# Altium schematic sheet Ring 3.SchDoc
size A; SheetNumber: 13; SheetTotal: 30
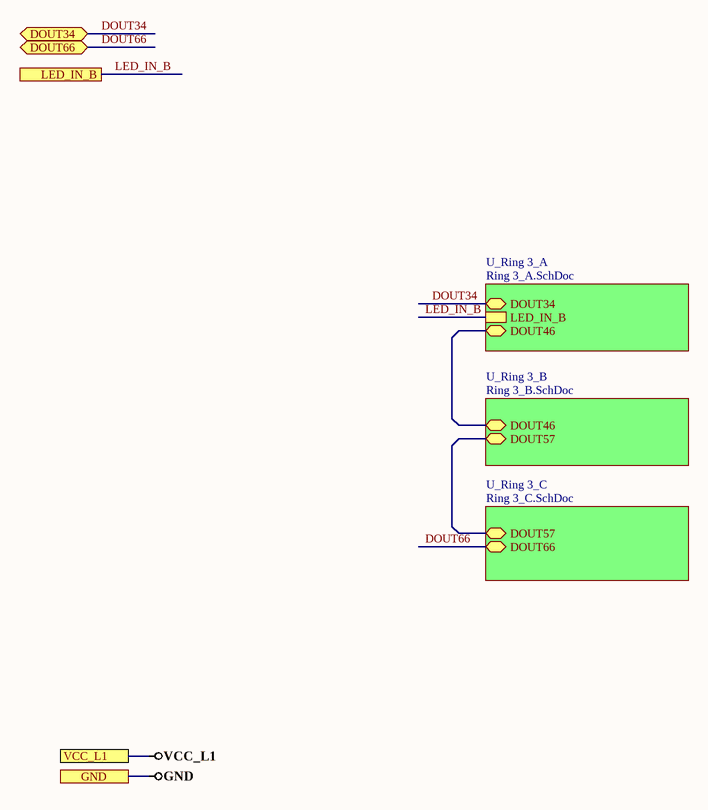
[diagram p0: Ring 3.SchDoc]

## Sub-sheets
U_Ring 3_A = Ring 3_A.SchDoc: DOUT34 (bidir), DOUT46 (bidir), LED_IN_B
U_Ring 3_B = Ring 3_B.SchDoc: DOUT57 (bidir), DOUT46 (bidir)
U_Ring 3_C = Ring 3_C.SchDoc: DOUT66 (bidir), DOUT57 (bidir)

## Ports
DOUT34 (bidir), DOUT66 (bidir), GND, LED_IN_B, VCC_L1

## Nets
GND: port GND
VCC_L1: port VCC_L1
DOUT34: port DOUT34, sheet U_Ring 3_A/DOUT34
DOUT66: port DOUT66, sheet U_Ring 3_C/DOUT66
LED_IN_B: port LED_IN_B, sheet U_Ring 3_A/LED_IN_B
(unnamed): sheet U_Ring 3_B/DOUT57, sheet U_Ring 3_C/DOUT57
(unnamed): sheet U_Ring 3_B/DOUT46, sheet U_Ring 3_A/DOUT46